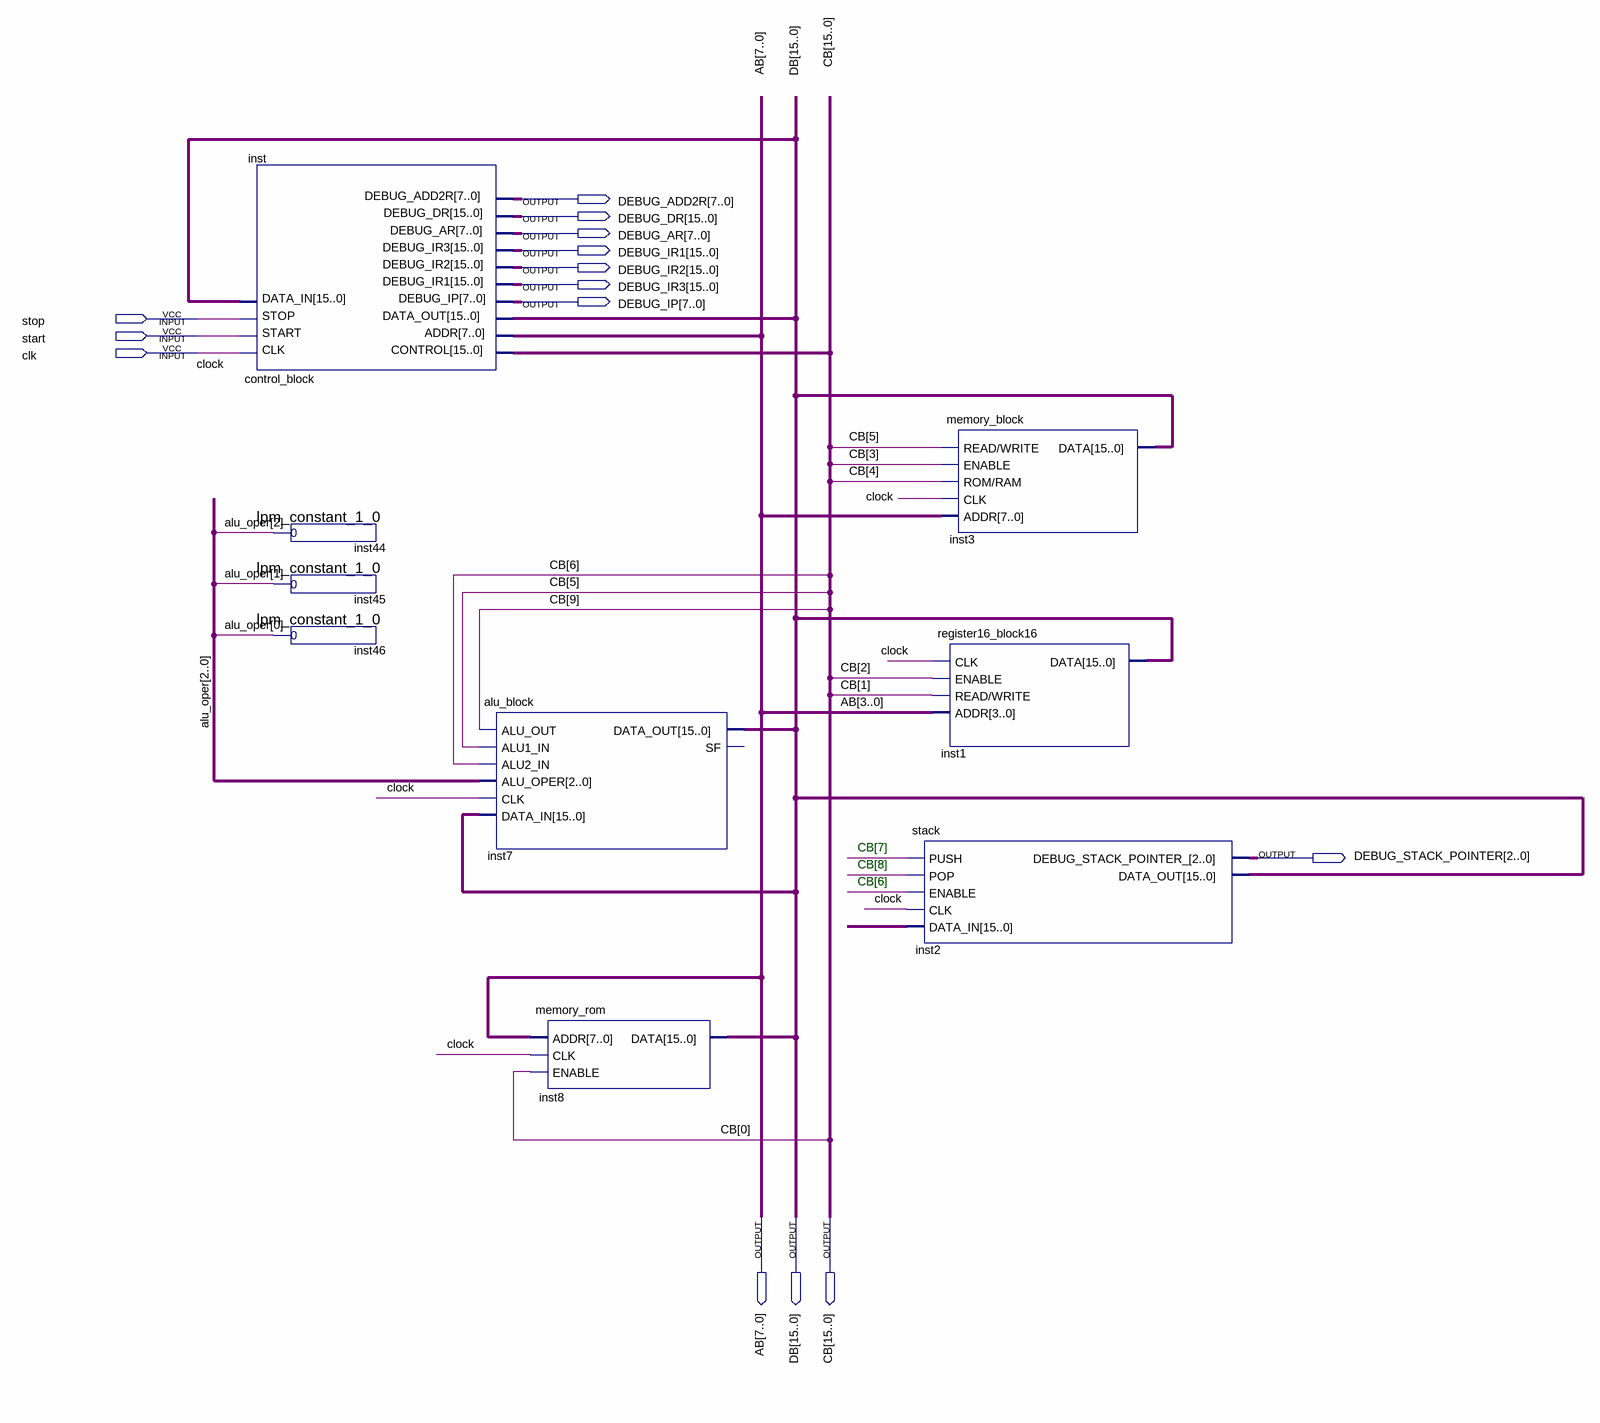
[diagram p0: schematic sheet]
// Quartus schematic cpu_bak.bdf as structural Verilog: 9 symbols, 14 pins
module cpu_bak (
  input  stop,
  input  start,
  input  clk,
  output [7:0] DEBUG_ADD2R,
  output [15:0] DEBUG_DR,
  output [7:0] DEBUG_AR,
  output [15:0] DEBUG_IR1,
  output [15:0] DEBUG_IR2,
  output [15:0] DEBUG_IR3,
  output [7:0] DEBUG_IP,
  output [2:0] DEBUG_STACK_POINTER,
  output [7:0] AB,
  output [15:0] DB,
  output [15:0] CB
);

  wire [2:0] alu_oper;
  wire [15:0] undriven;

  control_block inst (
    .CLK(clk), .START(start), .STOP(stop), .DATA_IN(DB), .CONTROL(CB), .ADDR(AB), .DATA_OUT(DB),
    .DEBUG_IP(DEBUG_IP), .DEBUG_IR1(DEBUG_IR3), .DEBUG_IR2(DEBUG_IR2), .DEBUG_IR3(DEBUG_IR1),
    .DEBUG_AR(DEBUG_AR), .DEBUG_DR(DEBUG_DR), .DEBUG_ADD2R(DEBUG_ADD2R));
  lpm_constant_1_0 inst44 (.result(alu_oper[2]));
  lpm_constant_1_0 inst45 (.result(alu_oper[1]));
  lpm_constant_1_0 inst46 (.result(alu_oper[0]));
  alu_block inst7 (
    .ALU_OUT(CB[9]), .ALU1_IN(CB[5]), .ALU2_IN(CB[6]), .ALU_OPER(alu_oper), .CLK(clk), .DATA_IN(DB),
    .DATA_OUT(DB));  // open: SF
  memory_rom inst8 (.ADDR(AB), .CLK(clk), .ENABLE(CB[0]), .DATA(DB));
  memory_block inst3 (.\READ/WRITE (CB[5]), .ENABLE(CB[3]), .\ROM/RAM (CB[4]), .CLK(clk), .ADDR(AB), .DATA(DB));
  register16_block16 inst1 (.CLK(clk), .ENABLE(CB[2]), .\READ/WRITE (CB[1]), .ADDR(AB[3:0]), .DATA(DB));
  stack inst2 (
    .PUSH(CB[7]), .POP(CB[8]), .ENABLE(CB[6]), .CLK(clk), .DATA_IN(undriven),
    .DEBUG_STACK_POINTER_(DEBUG_STACK_POINTER), .DATA_OUT(DB));

  // Other names for the same wires on the sheet: clock = clk

  // Notes on the sheet:
  //   CB[7]
  //   CB[8]
  //   CB[6]
endmodule
